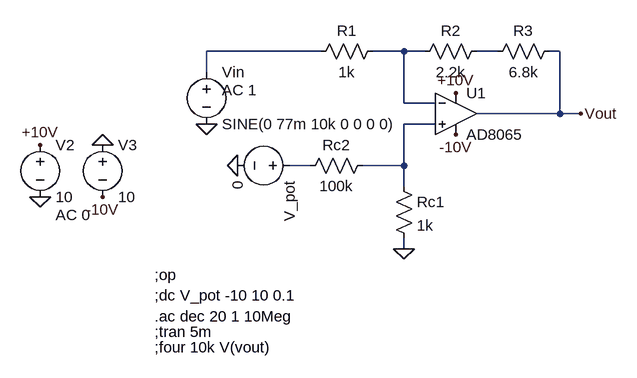
[diagram p0: schematic Etaj1.asc]
Etaj1.asc, the LTspice schematic file:
Version 4.1
SHEET 1 880 680
WIRE -32 -176 -208 -176
WIRE 96 -176 48 -176
WIRE 128 -176 96 -176
WIRE 240 -176 208 -176
WIRE 336 -176 320 -176
WIRE -208 -144 -208 -176
WIRE 96 -96 96 -176
WIRE 144 -96 96 -96
WIRE 336 -80 336 -176
WIRE 336 -80 208 -80
WIRE 368 -80 336 -80
WIRE 144 -64 96 -64
WIRE -48 0 -80 0
WIRE 96 0 96 -64
WIRE 96 0 32 0
WIRE 96 32 96 0
WIRE 96 128 96 112
FLAG 96 128 0
FLAG -160 0 0
FLAG -208 -64 0
FLAG -464 48 0
FLAG -464 -32 +10V
FLAG -368 -32 0
FLAG -368 48 -10V
FLAG 176 -112 +10V
FLAG 176 -48 -10V
FLAG 368 -80 Vout
SYMBOL voltage -208 -160 R0
WINDOW 123 24 44 Left 2
WINDOW 39 0 0 Left 0
SYMATTR Value2 AC 1
SYMATTR InstName Vin
SYMATTR Value SINE(0 77m 10k 0 0 0 0)
SYMBOL res 64 -192 R90
WINDOW 0 0 56 VBottom 2
WINDOW 3 32 56 VTop 2
SYMATTR InstName R1
SYMATTR Value 1k
SYMBOL res 224 -192 R90
WINDOW 0 0 56 VBottom 2
WINDOW 3 32 56 VTop 2
SYMATTR InstName R2
SYMATTR Value 2.2k
SYMBOL OpAmps\\AD8065 176 -144 R0
SYMATTR InstName U1
SYMBOL res 80 16 R0
SYMATTR InstName Rc1
SYMATTR Value 1k
SYMBOL res 48 -16 R90
WINDOW 0 0 56 VBottom 2
WINDOW 3 32 56 VTop 2
SYMATTR InstName Rc2
SYMATTR Value 100k
SYMBOL voltage -64 0 R90
WINDOW 123 0 0 Left 0
WINDOW 39 0 0 Left 0
SYMATTR InstName V_pot
SYMATTR Value 0
SYMBOL voltage -464 -48 R0
WINDOW 123 24 124 Left 2
WINDOW 39 0 0 Left 0
SYMATTR Value2 AC 0
SYMATTR InstName V2
SYMATTR Value 10
SYMBOL voltage -368 -48 R0
WINDOW 123 0 0 Left 0
WINDOW 39 0 0 Left 0
SYMATTR InstName V3
SYMATTR Value 10
SYMBOL res 336 -192 R90
WINDOW 0 0 56 VBottom 2
WINDOW 3 32 56 VTop 2
SYMATTR InstName R3
SYMATTR Value 6.8k
TEXT -288 168 Left 2 !;op
TEXT -288 200 Left 2 !;dc V_pot -10 10 0.1
TEXT -288 232 Left 2 !.ac dec 20 1 10Meg
TEXT -288 256 Left 2 !;tran 5m
TEXT -288 280 Left 2 !;four 10k V(vout)

The netlist it stands for:
* Etaj1.asc
Vin N001 0 SINE(0 77m 10k 0 0 0 0) AC 1
R1 N002 N001 1k
R2 N003 N002 2.2k
X§U1 N004 N002 +10V -10V Vout AD8065  ; pins In+ In- V+ V- OUT
Rc1 N004 0 1k
Rc2 N004 N005 100k
V_pot N005 0 0
V2 +10V 0 10 AC 0
V3 0 -10V 10
R3 Vout N003 6.8k
;op
;dc V_pot -10 10 0.1
.ac dec 20 1 10Meg
;tran 5m
;four 10k V(vout)
.backanno
.end